# Altium schematic sheet controller.SchDoc
size B
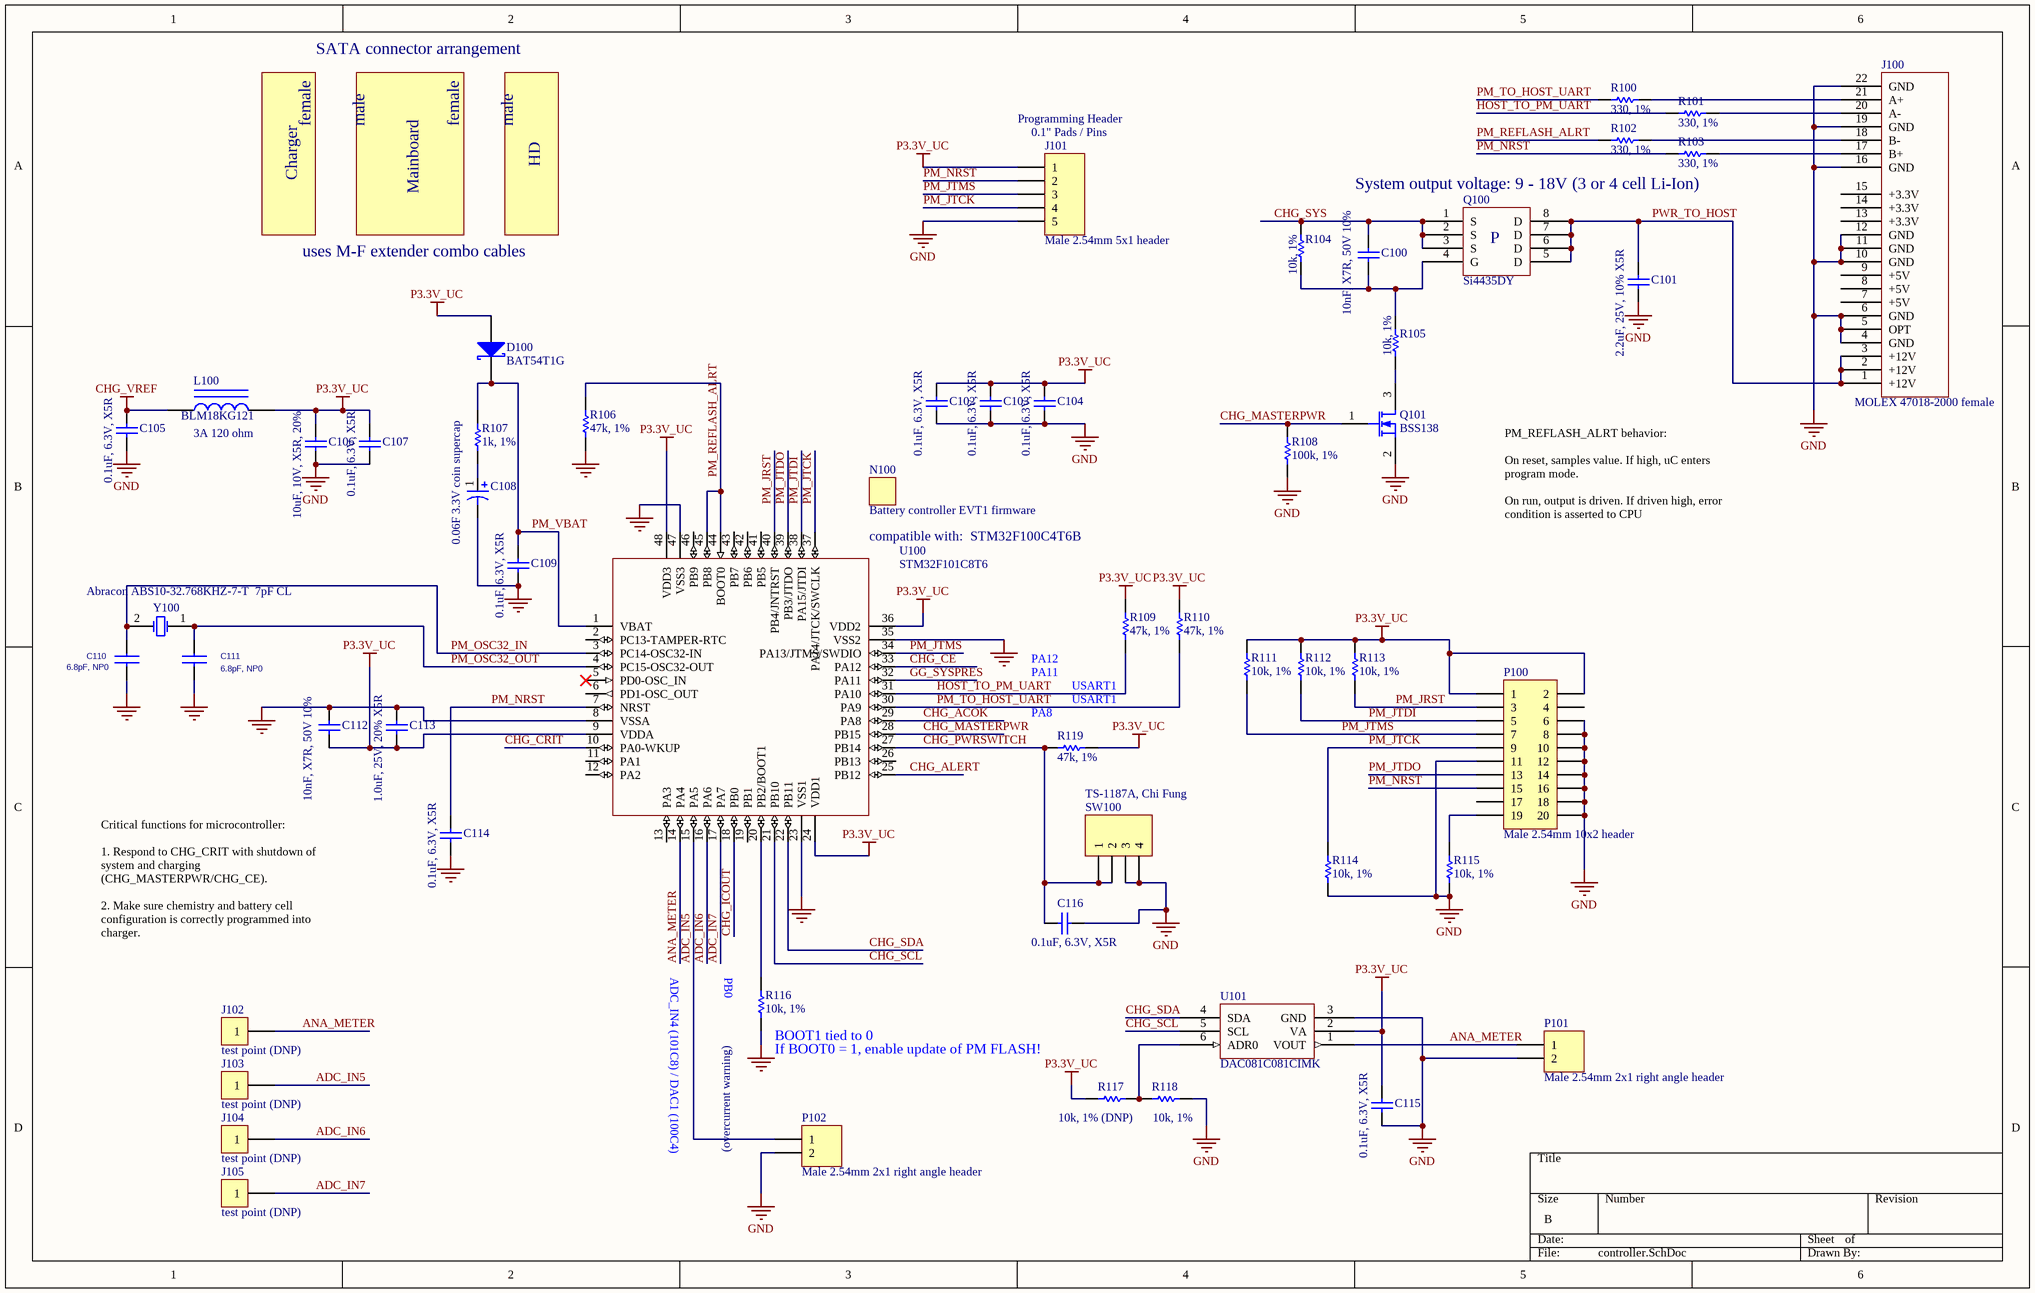
[diagram p0: controller.SchDoc]

## Parts
C100  10nF, X7R, 50V 10%  [CAPC1005N]
C101  2.2uF, 25V, 10% X5R  [CAPC1608N]
C102  0.1uF, 6.3V, X5R  [CAPC0603N_B]
C103  0.1uF, 6.3V, X5R  [CAPC0603N_B]
C104  0.1uF, 6.3V, X5R  [CAPC0603N_B]
C105  0.1uF, 6.3V, X5R  [CAPC0603N_B]
C106  10uF, 10V, X5R, 20%  [CAPC1608N]
C107  0.1uF, 6.3V, X5R  [CAPC0603N_B]
C108  0.06F 3.3V coin supercap  [TAIYO_YUDEN_PAS414HR-VA5R]
C109  0.1uF, 6.3V, X5R  [CAPC0603N_B]
C110  6.8pF, NP0  [CAPC1005N]
C111  6.8pF, NP0  [CAPC1005N]
C112  10nF, X7R, 50V 10%  [CAPC1005N]
C113  1.0uF, 25V, 20% X5R  [CAPC1608N]
C114  0.1uF, 6.3V, X5R  [CAPC0603N_B]
C115  0.1uF, 6.3V, X5R  [CAPC0603N_B]
C116  0.1uF, 6.3V, X5R  [CAPC0603N_B]
D100  BAT54T1G  [SOD123]
J100  MOLEX 47018-2000 female  [SATA_MOLEX_47018_2000]
J101  Male 2.54mm 5x1 header  [HDR1X5]
J102  test point (DNP)  [TP_SMT_38mil]
J103  test point (DNP)  [TP_SMT_38mil]
J104  test point (DNP)  [TP_SMT_38mil]
J105  test point (DNP)  [TP_SMT_38mil]
L100  BLM18KG121  value 3A 120 ohm  [INDC1608AN]
N100  Battery controller EVT1 firmware
P100  Male 2.54mm 10x2 header  [HDR2X10]
P101  Male 2.54mm 2x1 right angle header  [HDR1X2H]
P102  Male 2.54mm 2x1 right angle header  [HDR1X2H]
Q100  Si4435DY  [SOIC127P600-8AN]
Q101  BSS138  [SOT23-3N]
R100  330, 1%  [RESC1005N]
R101  330, 1%  [RESC1005N]
R102  330, 1%  [RESC1005N]
R103  330, 1%  [RESC1005N]
R104  10k, 1%  [RESC1005N]
R105  10k, 1%  [RESC1005N]
R106  47k, 1%  [RESC1005N]
R107  1k, 1%  [RESC1005N]
R108  100k, 1%  [RESC1005N]
R109  47k, 1%  [RESC1005N]
R110  47k, 1%  [RESC1005N]
R111  10k, 1%  [RESC1005N]
R112  10k, 1%  [RESC1005N]
R113  10k, 1%  [RESC1005N]
R114  10k, 1%  [RESC1005N]
R115  10k, 1%  [RESC1005N]
R116  10k, 1%  [RESC1005N]
R117  10k, 1% (DNP)  [RESC1005N]
R118  10k, 1%  [RESC1005N]
R119  47k, 1%  [RESC1005N]
SW100  TS-1187A, Chi Fung  [SWITCH_TS-1187A]
U100  STM32F101C8T6  [TSQFP50P900X900-48N]
U101  DAC081C081CIMK  [SOT26A-6N]
Y100  Abracon ABS10-32.768KHZ-7-T  7pF CL  [ABS10-32.768KHZ]

## Nets
CHG_VREF: C105.1 L100.1
GND: C101.2 C102.2 C103.2 C104.2 C105.2 C106.2 C107.2 C108.2 C109.2 C110.2 C111.2 C112.1 C113.1 C114.2 C115.2 C116.1 J100.4(GND) J100.5(OPT) J100.6(GND) J100.10(GND) J100.11(GND) J100.12(GND) J100.16(GND) J100.19(GND) J100.22(GND) J101.5 P100.6 P100.8 P100.10 P100.11 P100.12 P100.14 P100.16 P100.18 P100.20 P101.2 P102.2 Q101.2(S) R106.1 R108.1 R114.1 R115.1 R116.1 R118.2 SW100.3 SW100.4 U100.8(VSSA) U100.23(VSS1) U100.35(VSS2) U100.47(VSS3) U101.3(GND)
P3.3V_UC: C102.1 C103.1 C104.1 C106.1 C107.1 C112.2 C113.2 C115.1 D100.1(A) J101.1 L100.2 P100.1 P100.2 R109.2 R110.2 R111.2 R112.2 R113.2 R117.1 R119.2 U100.9(VDDA) U100.24(VDD1) U100.36(VDD2) U100.48(VDD3) U101.2(VA)
ADC_IN5: J103.1 P102.1 U100.15(PA5)
ADC_IN6: J104.1 U100.16(PA6)
ADC_IN7: J105.1 U100.17(PA7)
ANA_METER: J102.1 P101.1 U100.14(PA4) U101.1(VOUT)
CHG_ACOK: U100.29(PA8)
CHG_ALERT: U100.25(PB12)
CHG_CE: U100.33(PA12)
CHG_CRIT: U100.10(PA0-WKUP)
CHG_ICOUT: U100.18(PB0)
CHG_MASTERPWR: Q101.1(G) R108.2 U100.28(PB15)
CHG_PWRSWITCH: C116.2 R119.1 SW100.1 SW100.2 U100.27(PB14)
CHG_SCL: U100.21(PB10) U101.5(SCL)
CHG_SDA: U100.22(PB11) U101.4(SDA)
CHG_SYS: C100.1 Q100.1(S) Q100.2(S) Q100.3(S) R104.2
GG_SYSPRES: U100.32(PA11)
HOST_TO_PM_UART: R101.1 R109.1 U100.31(PA10)
PM_JRST: P100.3 R113.1 U100.40(PB4/JNTRST)
PM_JTCK: J101.4 P100.9 R114.2 U100.37(PA14/JTCK/SWCLK)
PM_JTDI: P100.5 R112.1 U100.38(PA15/JTDI)
PM_JTDO: P100.13 U100.39(PB3/JTDO)
PM_JTMS: J101.3 P100.7 R111.1 U100.34(PA13/JTMS/SWDIO)
PM_NRST: C114.1 J101.2 P100.15 R103.1 U100.7(NRST)
PM_OSC32_IN: C110.1 U100.3(PC14-OSC32-IN) Y100.2(OSC2)
PM_OSC32_OUT: C111.1 U100.4(PC15-OSC32-OUT) Y100.1(OSC1)
PM_REFLASH_ALRT: R102.1 R106.2 U100.44(BOOT0) U100.45(PB8)
PM_TO_HOST_UART: R100.1 R110.1 U100.30(PA9)
PM_VBAT: C109.1 D100.2(K) R107.2 U100.1(VBAT)
PWR_TO_HOST: C101.1 J100.1(+12V) J100.2(+12V) J100.3(+12V) Q100.5(D) Q100.6(D) Q100.7(D) Q100.8(D)
NetC100_2: C100.2 Q100.4(G) R104.1 R105.2
NetC108_1: C108.1 R107.1
NetJ100_17: J100.17(B+) R103.2
NetJ100_18: J100.18(B-) R102.2
NetJ100_20: J100.20(A-) R101.2
NetJ100_21: J100.21(A+) R100.2
NetP100_19: P100.19 R115.2
NetQ101_3: Q101.3(D) R105.1
NetR116_2: R116.2 U100.20(PB2/BOOT1)
NetR117_2: R117.2 R118.1 U101.6(ADR0)

Not connected (* = marked no-connect by the designer): J100 7(+5V) 8(+5V) 9(+5V) 13(+3.3V) 14(+3.3V) 15(+3.3V); P100 4 17; U100 2(PC13-TAMPER-RTC) 5(PD0-OSC_IN)* 6(PD1-OSC_OUT) 11(PA1) 12(PA2) 13(PA3) 19(PB1) 26(PB13) 41(PB5) 42(PB6) 43(PB7) 46(PB9)

## Notes on the sheet
- SATA connector arrangement
- female
- male
- HD
- (near J101) Programming Header
- (near J101) 0.1" Pads / Pins
- Charger
- Mainboard
- System output voltage: 9 - 18V (3 or 4 cell Li-Ion)
- uses M-F extender combo cables
- (near U100) compatible with:  STM32F100C4T6B
- PM_REFLASH_ALRT behavior:
  On reset, samples value. If high, uC enters program mode.
  On run, output is driven. If driven high, error condition is asserted to CPU
- PA11
- PA12
- USART1
- (near R119) PA8
- Critical functions for microcontroller:
  1. Respond to CHG_CRIT with shutdown of system and charging (CHG_MASTERPWR/CHG_CE).
  2. Make sure chemistry and battery cell configuration is correctly programmed into charger.
- ADC_IN4 (101C8) / DAC1 (100C4)
- (near R116) PB0
- (near R116) BOOT1 tied to 0
- (near R116) If BOOT0 = 1, enable update of PM FLASH!
- (near R116) (overcurrent warning)
- (in symbol Si4435DY) P

## Library data of the parts
C100-C107 C109 C112-C116 = Cap Semi: Capacitor (Semiconductor SIM Model); Published: 8-Jun-2000; LatestRevisionDate: 17-Jul-2002; LatestRevisionNote: Re-released for DXP Platform.; PackageReference: C1206; Publisher: Altium Limited
C108 = Cap Pol3: Taiyo Yuden PAS414HR-VA5R; Published: 8-Jun-2000; LatestRevisionDate: 17-Jul-2002; LatestRevisionNote: Re-released for DXP Platform.; PackageReference: C0805; Publisher: Altium Limited
C110 C111 = CAP NP: Right: 20; Bottom: 10
D100 = D Schottky: Schottky Diode; Code - JEDEC: DO-214-AA; Published: 8-Jun-2000; Publisher: Altium Limited; Revision: July-2002: Re-released for DXP Platform.
J100 = SATA_22P_HEADER: SATA+Power connector
J101 = Header 5: Header, 5-Pin; LatestRevisionDate: 17-Jul-2002; LatestRevisionNote: Re-released for DXP Platform.; Publisher: Altium Limited
J102-J105 = CON1: Connector
L100 = Inductor Iron: Magnetic-Core Inductor; Published: 24-Mar-1999; LatestRevisionDate: 17-Jul-2002; LatestRevisionNote: Re-released for DXP Platform.; PackageReference: AXIAL-0.9; Publisher: Altium Limited
N100 = NOTE: Placeholder for non-electrical BOM items
P100 = Header 10X2: Header, 10-Pin, Dual row; LatestRevisionDate: 17-Jul-2002; LatestRevisionNote: Re-released for DXP Platform.; Publisher: Altium Limited
P101 P102 = Header 2H: Header, 2-Pin, Right Angle; LatestRevisionDate: 17-Jul-2002; LatestRevisionNote: Re-released for DXP Platform.; Publisher: Altium Limited
Q100 = Si4435DY: Singre P-channel FET, 8A, 30V
Q101 = MOSFET-N: N-Channel MOSFET; Published: 8-Jun-2000; LatestRevisionDate: 17-Jul-2002; LatestRevisionNote: Re-released for DXP Platform.; PackageVersion: 1995/1996; PackageReference: E3; Publisher: Altium Limited
R100-R107 R109-R119 = Res1: Resistor; Value: 100k; Published: 8-Jun-2000; LatestRevisionDate: 17-Jul-2002; LatestRevisionNote: Re-released for DXP Platform.; PackageReference: AXIAL-0.3; Publisher: Altium Limited
R108 = Res1: Resistor; Published: 8-Jun-2000; LatestRevisionDate: 17-Jul-2002; LatestRevisionNote: Re-released for DXP Platform.; PackageReference: AXIAL-0.3; Publisher: Altium Limited; Value: 100k
SW100 = Header 4: Chi Fung TS-1187A; LatestRevisionDate: 17-Jul-2002; LatestRevisionNote: Re-released for DXP Platform.; Publisher: Altium Limited
U100 = STM32F103C8T6: 32-bit ARM Coretex high performance microcontroller
U101 = DAC081C81CIMK: Single 8-bit DAC for I2C bus
Y100 = XTAL: Crystal Oscillator; Published: 8-Jun-2000; LatestRevisionDate: 17-Jul-2002; LatestRevisionNote: Re-released for DXP Platform.; PackageReference: R38; Publisher: Altium Limited